# EAGLE schematic test2 (EAGLE 6.6.0)
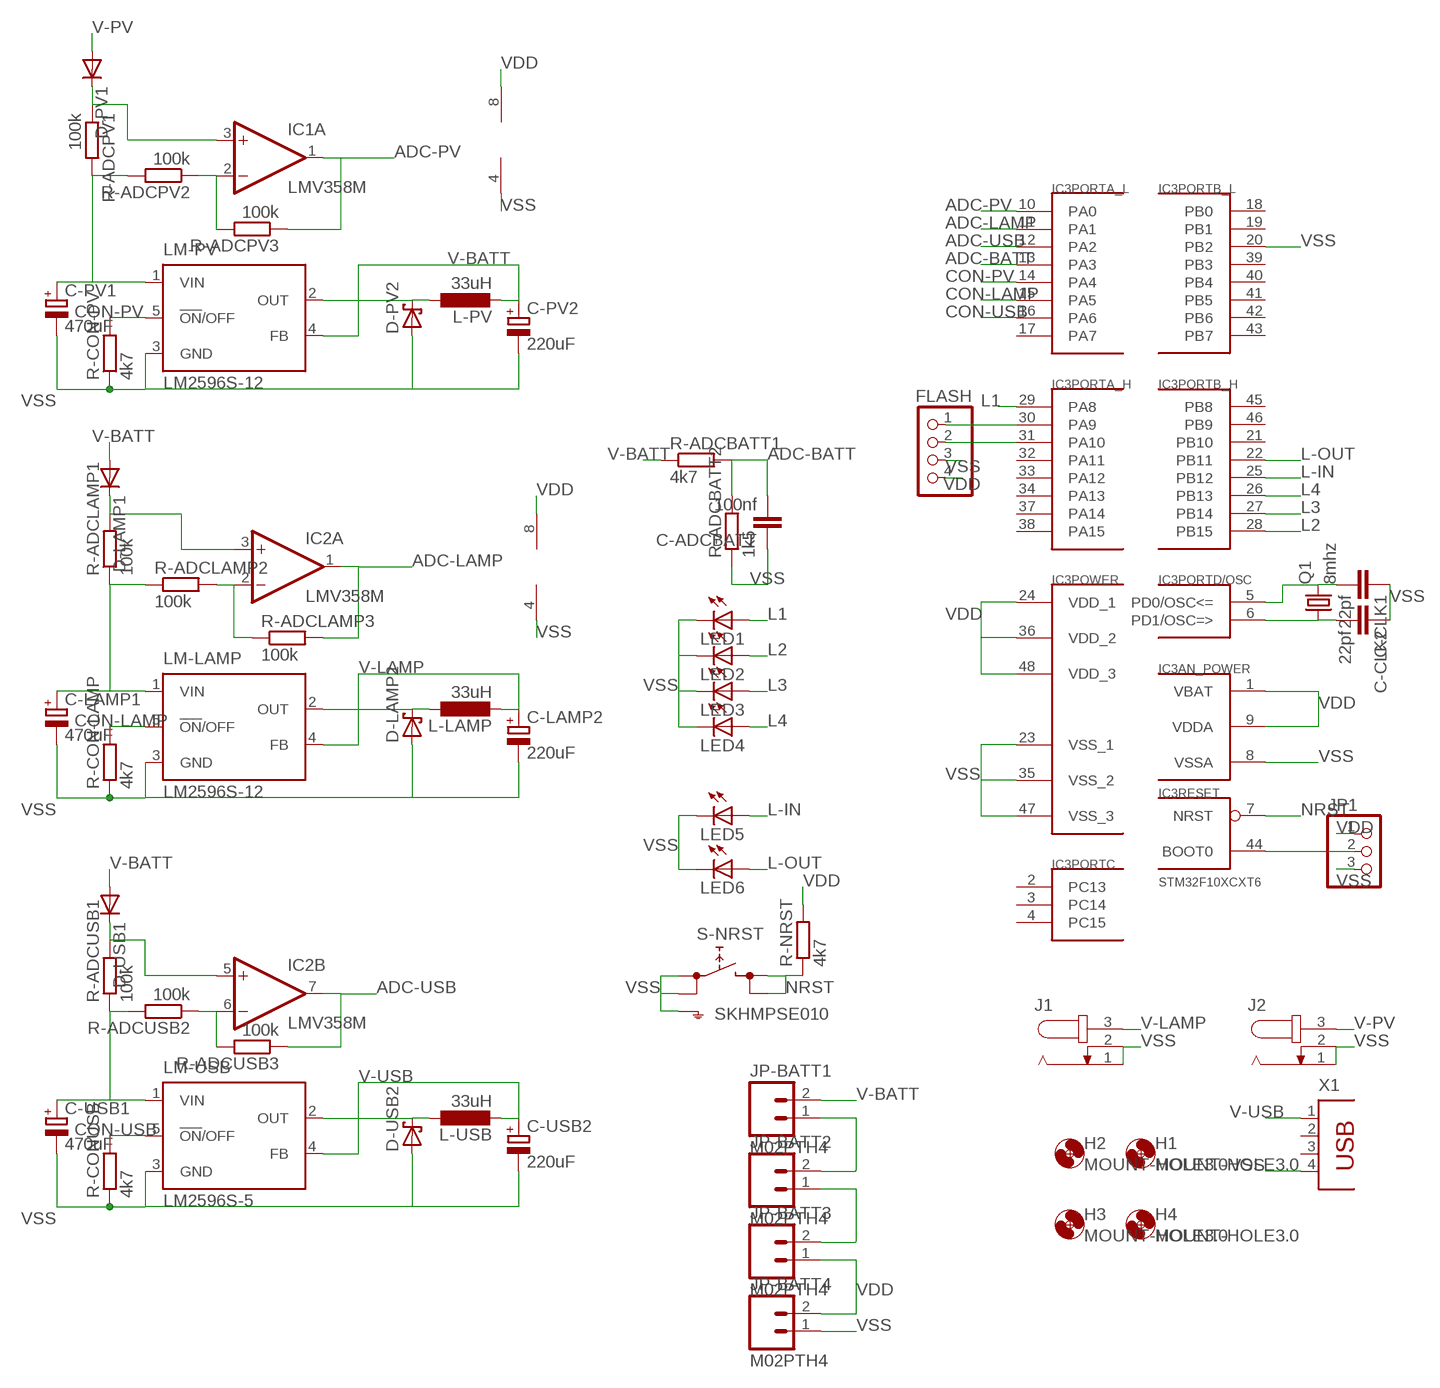
[diagram p0: schematic, sheet 1]

## Parts
C-ADCBATT  100nf  C-EUC0805  [C0805]
C-CLK1  22pf  C-EUC0805  [C0805]
C-CLK2  22pf  C-EUC0805  [C0805]
C-LAMP1  470uF  CPOL-EUE2.5-5  [E2,5-5]
C-LAMP2  220uF  CPOL-EUE2.5-5  [E2,5-5]
C-PV1  470uF  CPOL-EUE2.5-5  [E2,5-5]
C-PV2  220uF  CPOL-EUE2.5-5  [E2,5-5]
C-USB1  470uF  CPOL-EUE2.5-5  [E2,5-5]
C-USB2  220uF  CPOL-EUE2.5-5  [E2,5-5]
D-LAMP1  DIODE-DO-214AC  [DO-214AC]
D-LAMP2  SCHOTTKY-DIODE  [DIODE_SMB]
D-PV1  DIODE-DO-214AC  [DO-214AC]
D-PV2  SCHOTTKY-DIODE  [DIODE_SMB]
D-USB1  DIODE-DO-214AC  [DO-214AC]
D-USB2  SCHOTTKY-DIODE  [DIODE_SMB]
FLASH  PINHD-1X4  [1X04]
H1  MOUNT-HOLE3.0  [3,0]
H2  MOUNT-HOLE3.0  [3,0]
H3  MOUNT-HOLE3.0  [3,0]
H4  MOUNT-HOLE3.0  [3,0]
IC1  LMV358M  [SO08]
IC2  LMV358M  [SO08]
IC3  STM32F10XCXT6  [TQFP48]
J1  JACK-PLUG0  [SPC4077]
J2  JACK-PLUG0  [SPC4077]
JP1  PINHD-1X3  [1X03]
JP-BATT1  M02PTH4  [1X02_XTRA_BIG]
JP-BATT2  M02PTH4  [1X02_XTRA_BIG]
JP-BATT3  M02PTH4  [1X02_XTRA_BIG]
JP-BATT4  M02PTH4  [1X02_XTRA_BIG]
L-LAMP  33uH  L-EUWE-TPC  [POWER-CHOKE_WE-TPC]
L-PV  33uH  L-EUWE-TPC  [POWER-CHOKE_WE-TPC]
L-USB  33uH  L-EUWE-TPC  [POWER-CHOKE_WE-TPC]
LED1  LEDCHIP-LED0805  [CHIP-LED0805]
LED2  LEDCHIP-LED0805  [CHIP-LED0805]
LED3  LEDCHIP-LED0805  [CHIP-LED0805]
LED4  LEDCHIP-LED0805  [CHIP-LED0805]
LED5  LEDCHIP-LED0805  [CHIP-LED0805]
LED6  LEDCHIP-LED0805  [CHIP-LED0805]
LM-LAMP  LM2596S-12  LM2596S  [TO263-5]
LM-PV  LM2596S-12  LM2596S  [TO263-5]
LM-USB  LM2596S-5  LM2596S  [TO263-5]
Q1  8mhz  CRYSTALHC49S  [HC49/S]
R-ADCBATT1  4k7  R-EU_R0805  [R0805]
R-ADCBATT2  1k5  R-EU_R0805  [R0805]
R-ADCLAMP1  100k  R-EU_R0805  [R0805]
R-ADCLAMP2  100k  R-EU_R0805  [R0805]
R-ADCLAMP3  100k  R-EU_R0805  [R0805]
R-ADCPV1  100k  R-EU_R0805  [R0805]
R-ADCPV2  100k  R-EU_R0805  [R0805]
R-ADCPV3  100k  R-EU_R0805  [R0805]
R-ADCUSB1  100k  R-EU_R0805  [R0805]
R-ADCUSB2  100k  R-EU_R0805  [R0805]
R-ADCUSB3  100k  R-EU_R0805  [R0805]
R-CON-LAMP  4k7  R-EU_R0805  [R0805]
R-CON-PV  4k7  R-EU_R0805  [R0805]
R-CONUSB  4k7  R-EU_R0805  [R0805]
R-NRST  4k7  R-EU_R0805  [R0805]
S-NRST  SKHMPSE010  [SKHMPXE010]
X1  PN87520  [PN87520]

## Nets
ADC-BATT: C-ADCBATT.2 IC3.13(PORTA_L:PA3) R-ADCBATT1.2 R-ADCBATT2.2
ADC-LAMP: IC2.1(A:OUT) IC3.11(PORTA_L:PA1) R-ADCLAMP3.2
ADC-PV: IC1.1(A:OUT) IC3.10(PORTA_L:PA0) R-ADCPV3.1
ADC-USB: IC2.7(B:OUT) IC3.12(PORTA_L:PA2) R-ADCUSB3.1
CON-LAMP: IC3.15(PORTA_L:PA5) LM-LAMP.5(!ON!/OFF) R-CON-LAMP.2
CON-PV: IC3.14(PORTA_L:PA4) LM-PV.5(!ON!/OFF) R-CON-PV.2
CON-USB: IC3.16(PORTA_L:PA6) LM-USB.5(!ON!/OFF) R-CONUSB.2
L1: IC3.29(PORTA_H:PA8) LED1.A
L2: IC3.28(PORTB_H:PB15) LED2.A
L3: IC3.27(PORTB_H:PB14) LED3.A
L4: IC3.26(PORTB_H:PB13) LED4.A
L-IN: IC3.25(PORTB_H:PB12) LED5.A
L-OUT: IC3.22(PORTB_H:PB11) LED6.A
N$1: D-PV2.C(A) L-PV.1 LM-PV.2(OUT)
N$2: D-LAMP2.C(A) L-LAMP.1 LM-LAMP.2(OUT)
N$3: D-USB2.C(A) L-USB.1 LM-USB.2(OUT)
N$4: IC2.2(A:-IN) R-ADCLAMP2.2 R-ADCLAMP3.1
N$5: C-USB1.+ LM-USB.1(VIN) R-ADCUSB1.1 R-ADCUSB2.2
N$6: C-CLK2.2 IC3.6(PORTD/OSC:PD1/OSC=>) Q1.1
N$7: C-LAMP1.+ LM-LAMP.1(VIN) R-ADCLAMP1.1 R-ADCLAMP2.1
N$8: D-LAMP1.C IC2.3(A:+IN) R-ADCLAMP1.2
N$9: IC1.2(A:-IN) R-ADCPV2.1 R-ADCPV3.2
N$10: C-PV1.+ LM-PV.1(VIN) R-ADCPV1.2 R-ADCPV2.2
N$11: D-PV1.C IC1.3(A:+IN) R-ADCPV1.1
N$12: IC3.44(RESET:BOOT0) JP1.2
N$13: C-CLK1.2 IC3.5(PORTD/OSC:PD0/OSC<=) Q1.2
N$14: IC2.6(B:-IN) R-ADCUSB2.1 R-ADCUSB3.2
N$15: D-USB1.C IC2.5(B:+IN) R-ADCUSB1.2
N$16: FLASH.2 IC3.31(PORTA_H:PA10)
N$17: FLASH.1 IC3.30(PORTA_H:PA9)
N$20: JP-BATT2.1 JP-BATT3.2
N$21: JP-BATT1.1 JP-BATT2.2
NRST: IC3.7(RESET:NRST) R-NRST.1 S-NRST.3(2.1) S-NRST.4(2.2)
V-BATT: C-PV2.+ D-LAMP1.A D-USB1.A JP-BATT1.2 L-PV.2 LM-PV.4(FB) R-ADCBATT1.1
V-LAMP: C-LAMP2.+ J1.3 L-LAMP.2 LM-LAMP.4(FB)
V-PV: D-PV1.A J2.3
V-USB: C-USB2.+ L-USB.2 LM-USB.4(FB) X1.1
VDD: FLASH.4 IC1.8(P:V+) IC2.8(P:V+) IC3.1(AN_POWER:VBAT) IC3.9(AN_POWER:VDDA) IC3.24(POWER:VDD_1) IC3.36(POWER:VDD_2) IC3.48(POWER:VDD_3) JP1.1 JP-BATT3.1 JP-BATT4.2 R-NRST.2
VSS: C-ADCBATT.1 C-CLK1.1 C-CLK2.1 C-LAMP1.- C-LAMP2.- C-PV1.- C-PV2.- C-USB1.- C-USB2.- D-LAMP2.A(C) D-PV2.A(C) D-USB2.A(C) FLASH.3 IC1.4(P:V-) IC2.4(P:V-) IC3.8(AN_POWER:VSSA) IC3.20(PORTB_L:PB2) IC3.23(POWER:VSS_1) IC3.35(POWER:VSS_2) IC3.47(POWER:VSS_3) J1.1 J1.2 J2.1 J2.2 JP1.3 JP-BATT4.1 LED1.C LED2.C LED3.C LED4.C LED5.C LED6.C LM-LAMP.3(GND) LM-PV.3(GND) LM-USB.3(GND) R-ADCBATT2.1 R-CON-LAMP.1 R-CON-PV.1 R-CONUSB.1 S-NRST.1(1.1) S-NRST.2(1.2) S-NRST.5(SH) X1.4
Unconnected: IC1.5(B:+IN) IC1.6(B:-IN) IC1.7(B:OUT) IC3.2(PORTC:PC13) IC3.3(PORTC:PC14) IC3.4(PORTC:PC15) IC3.17(PORTA_L:PA7) IC3.18(PORTB_L:PB0) IC3.19(PORTB_L:PB1) IC3.21(PORTB_H:PB10) IC3.32(PORTA_H:PA11) IC3.33(PORTA_H:PA12) IC3.34(PORTA_H:PA13) IC3.37(PORTA_H:PA14) IC3.38(PORTA_H:PA15) IC3.39(PORTB_L:PB3) IC3.40(PORTB_L:PB4) IC3.41(PORTB_L:PB5) IC3.42(PORTB_L:PB6) IC3.43(PORTB_L:PB7) IC3.45(PORTB_H:PB8) IC3.46(PORTB_H:PB9) X1.2 X1.3

## Library data of the parts
C-ADCBATT C-CLK1 C-CLK2 = resistor:C-EU: CAPACITOR, European symbol
C-LAMP1 C-LAMP2 C-PV1 C-PV2 C-USB1 C-USB2 = resistor:CPOL-EU: POLARIZED CAPACITOR, European symbol
D-LAMP1 D-PV1 D-USB1 = diode:DIODE-: DIODE
D-LAMP2 D-PV2 D-USB2 = eagle-ltspice:SCHOTTKY-DIODE: Schottky Diode; SPICEMODEL: NONE; SPICEPREFIX: D; SPICETYPE: diode
FLASH = pinhead:PINHD-1X4: PIN HEADER
H1-H4 = holes:MOUNT-HOLE: MOUNTING HOLE with drill center marker
IC1 IC2 = linear:LMV358?*: Dual General Purpose, Low Voltage, Rail-to-Rail Output Operational Amplifiers Source: http://www.national.com/mpf/LM/LMV321.html http://www.national.com/dt/lmv_qual.pdf
IC3 = stm32:STM32F10XCXT6: ST STM32F101/103 48pin LQFP
J1 J2 = con-jack:JACK-PLUG: DC POWER JACK Power Jack, DC, Right Angle, Through Hole, Rated 5A at 16VDC, PC Terminals Distributor: Farnell (www.Farnell.de) Drawing: 84N1161.pdf / 84N1162.pdf Manufacturer: SPC Technology (www.spctechnology.com) Type: SPC4077 / SPC 4078; OC_FARNELL: unknown; OC_NEWARK: unknown
JP1 = pinhead:PINHD-1X3: PIN HEADER
JP-BATT1-JP-BATT4 = SparkFun-Connectors:M02: Standard 2-pin 0.1" header. Use with - straight break away headers ( PRT-00116) - right angle break away headers (PRT-00553) - swiss pins (PRT-00743) - machine pins (PRT-00117) - female headers (PRT-00115) Molex polarized connector foot print use with: PRT-08233 with associated crimp pins and housings. 2.54_SCREWTERM for use with PRT-10571. 3.5mm Screw Terminal footprints for PRT-08084 5mm Screw Terminal footprints for use with PRT-08432
L-LAMP L-PV L-USB = resistor:L-EU: INDUCTOR, European symbol
LED1-LED6 = led:LED: LED OSRAM: - CHIPLED LG R971, LG N971, LY N971, LG Q971, LY Q971, LO R971, LY R971 LH N974, LH R974 LS Q976, LO Q976, LY Q976 LO Q996 - Hyper CHIPLED LW Q18S LB Q993, LB Q99A, LB R99A - SideLED LS A670, LO A670, LY A670, LG A670, LP A670 LB A673, LV A673, LT A673, LW A673 LH A674 LY A675 LS A676, LA A676, LO A676, LY A676, LW A676 LS A679, LY A679, LG A679 - Hyper Micro SIDELED® LS Y876, LA Y876, LO Y876, LY Y876 LT Y87S - SmartLED LW L88C, LW L88S LB L89C, LB L89S, LG L890 LS L89K, LO L89K, LY L89K LS L896, LA L896, LO L896, LY L896 - TOPLED LS T670, LO T670, LY T670, LG T670, LP T670 LSG T670, LSP T670, LSY T670, LOP T670, LYG T670 LG T671, LOG T671, LSG T671 LB T673, LV T673, LT T673, LW T673 LH T674 LS T676, LA T676, LO T676, LY T676, LB T676, LH T676, LSB T676, LW T676 LB T67C, LV T67C, LT T67C, LS T67K, LO T67K, LY T67K, LW E67C LS E67B, LA E67B, LO E67B, LY E67B, LB E67C, LV E67C, LT E67C LW T67C LS T679, LY T679, LG T679 LS T770, LO T770, LY T770, LG T770, LP T770 LB T773, LV T773, LT T773, LW T773 LH T774 LS E675, LA E675, LY E675, LS T675 LS T776, LA T776, LO T776, LY T776, LB T776 LHGB T686 LT T68C, LB T68C - Hyper Mini TOPLED® LB M676 - Mini TOPLED Santana® LG M470 LS M47K, LO M47K, LY M47K Source: http://www.osram.convergy.de LUXEON: - LUMILED® LXK2-PW12-R00, LXK2-PW12-S00, LXK2-PW14-U00, LXK2-PW14-V00 LXK2-PM12-R00, LXK2-PM12-S00, LXK2-PM14-U00 LXK2-PE12-Q00, LXK2-PE12-R00, LXK2-PE12-S00, LXK2-PE14-T00, LXK2-PE14-U00 LXK2-PB12-K00, LXK2-PB12-L00, LXK2-PB12-M00, LXK2-PB14-N00, LXK2-PB14-P00, LXK2-PB14-Q00 LXK2-PR12-L00, LXK2-PR12-M00, LXK2-PR14-Q00, LXK2-PR14-R00 LXK2-PD12-Q00, LXK2-PD12-R00, LXK2-PD12-S00 LXK2-PH12-R00, LXK2-PH12-S00 LXK2-PL12-P00, LXK2-PL12-Q00, LXK2-PL12-R00 Source: www.luxeon.com KINGBRIGHT: KA-3528ASYC Source: www.kingbright.com
LM-LAMP LM-PV LM-USB = national-semiconductor:LM2596: SIMPLE SWITCHER® Power Converter 150 kHz 3A Step-Down Voltage Regulator Source: http://www.national.com/ds/LM/LM2596.pdf; MF: NATIONAL SEMICONDUCTOR; MPN: LM2596S-ADJ/NOPB; OC_FARNELL: 9494367; OC_NEWARK: 41K3842
Q1 = crystal:CRYSTAL: CRYSTAL; OC_FARNELL: 1667008; OC_NEWARK: unknown
R-ADCBATT1 R-ADCBATT2 R-ADCLAMP1-R-ADCLAMP3 R-ADCPV1-R-ADCPV3 R-ADCUSB1-R-ADCUSB3 R-CON-LAMP R-CON-PV R-CONUSB R-NRST = resistor:R-EU_: RESISTOR, European symbol
S-NRST = switch:SKHMP*E010: 6.2 X 6.5mm TACT Switch (SMD) Source: http://www3.alps.co.jp/WebObjects/catalog.woa/PDF/E/Switch/Tact/SKHM/SKHM.PDF
X1 = con-berg:PN87520: BERG USB connector; OC_FARNELL: unknown; OC_NEWARK: unknown